# Altium schematic sheet Converter_Current to Voltage.SchDoc
size 55 x 38 mm
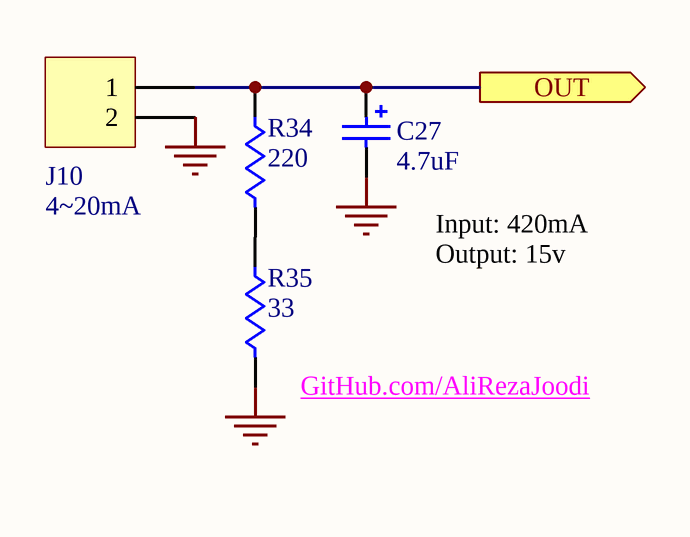
[diagram p0: Converter_Current to Voltage.SchDoc]

## Parts
C27  value 4.7uF  [CAPPR2.5-6.3x5]  (hidden comment: Cap Pol1)
J10  Header 2  [Fonics_2PIN_1]  (value not drawn)
R34  value 220  [AXIAL-0.4]  (hidden comment: Res1)
R35  value 33  [AXIAL-0.4]  (hidden comment: Res1)

## Ports
OUT (out)

## Nets
GND: C27.2 J10.2 R35.2
OUT: C27.1 J10.1 R34.1 ; port OUT
NetR34_2: R34.2 R35.1

## Notes on the sheet
- (near J10) 4~20mA
- (near C27) Input: 420mA
  Output: 15v
- (near R35) GitHub.com/AliRezaJoodi

## Library data of the parts
C27 = Cap Pol1: Polarized Capacitor (Radial); Manufacturer: Generic Components; Class I: Passive; Published: 8-Jun-2000; Revision: July-2002: Re-released for DXP Platform.; Publisher: Altium Limited; Class II: Capacitor
J10 = Header 2: Header, 2-Pin; LatestRevisionDate: 17-Jul-2002; LatestRevisionNote: Re-released for DXP Platform.; Publisher: Altium Limited
R34 R35 = Res1: Resistor; Manufacturer: Generic Components; Class I: Passive; Published: 8-Jun-2000; Revision: July-2002: Re-released for DXP Platform.; Publisher: Altium Limited; Class II: Resistor